# EAGLE design DebugCAN_v2 (EAGLE 9.7.0)

## Sheet 1 of 2
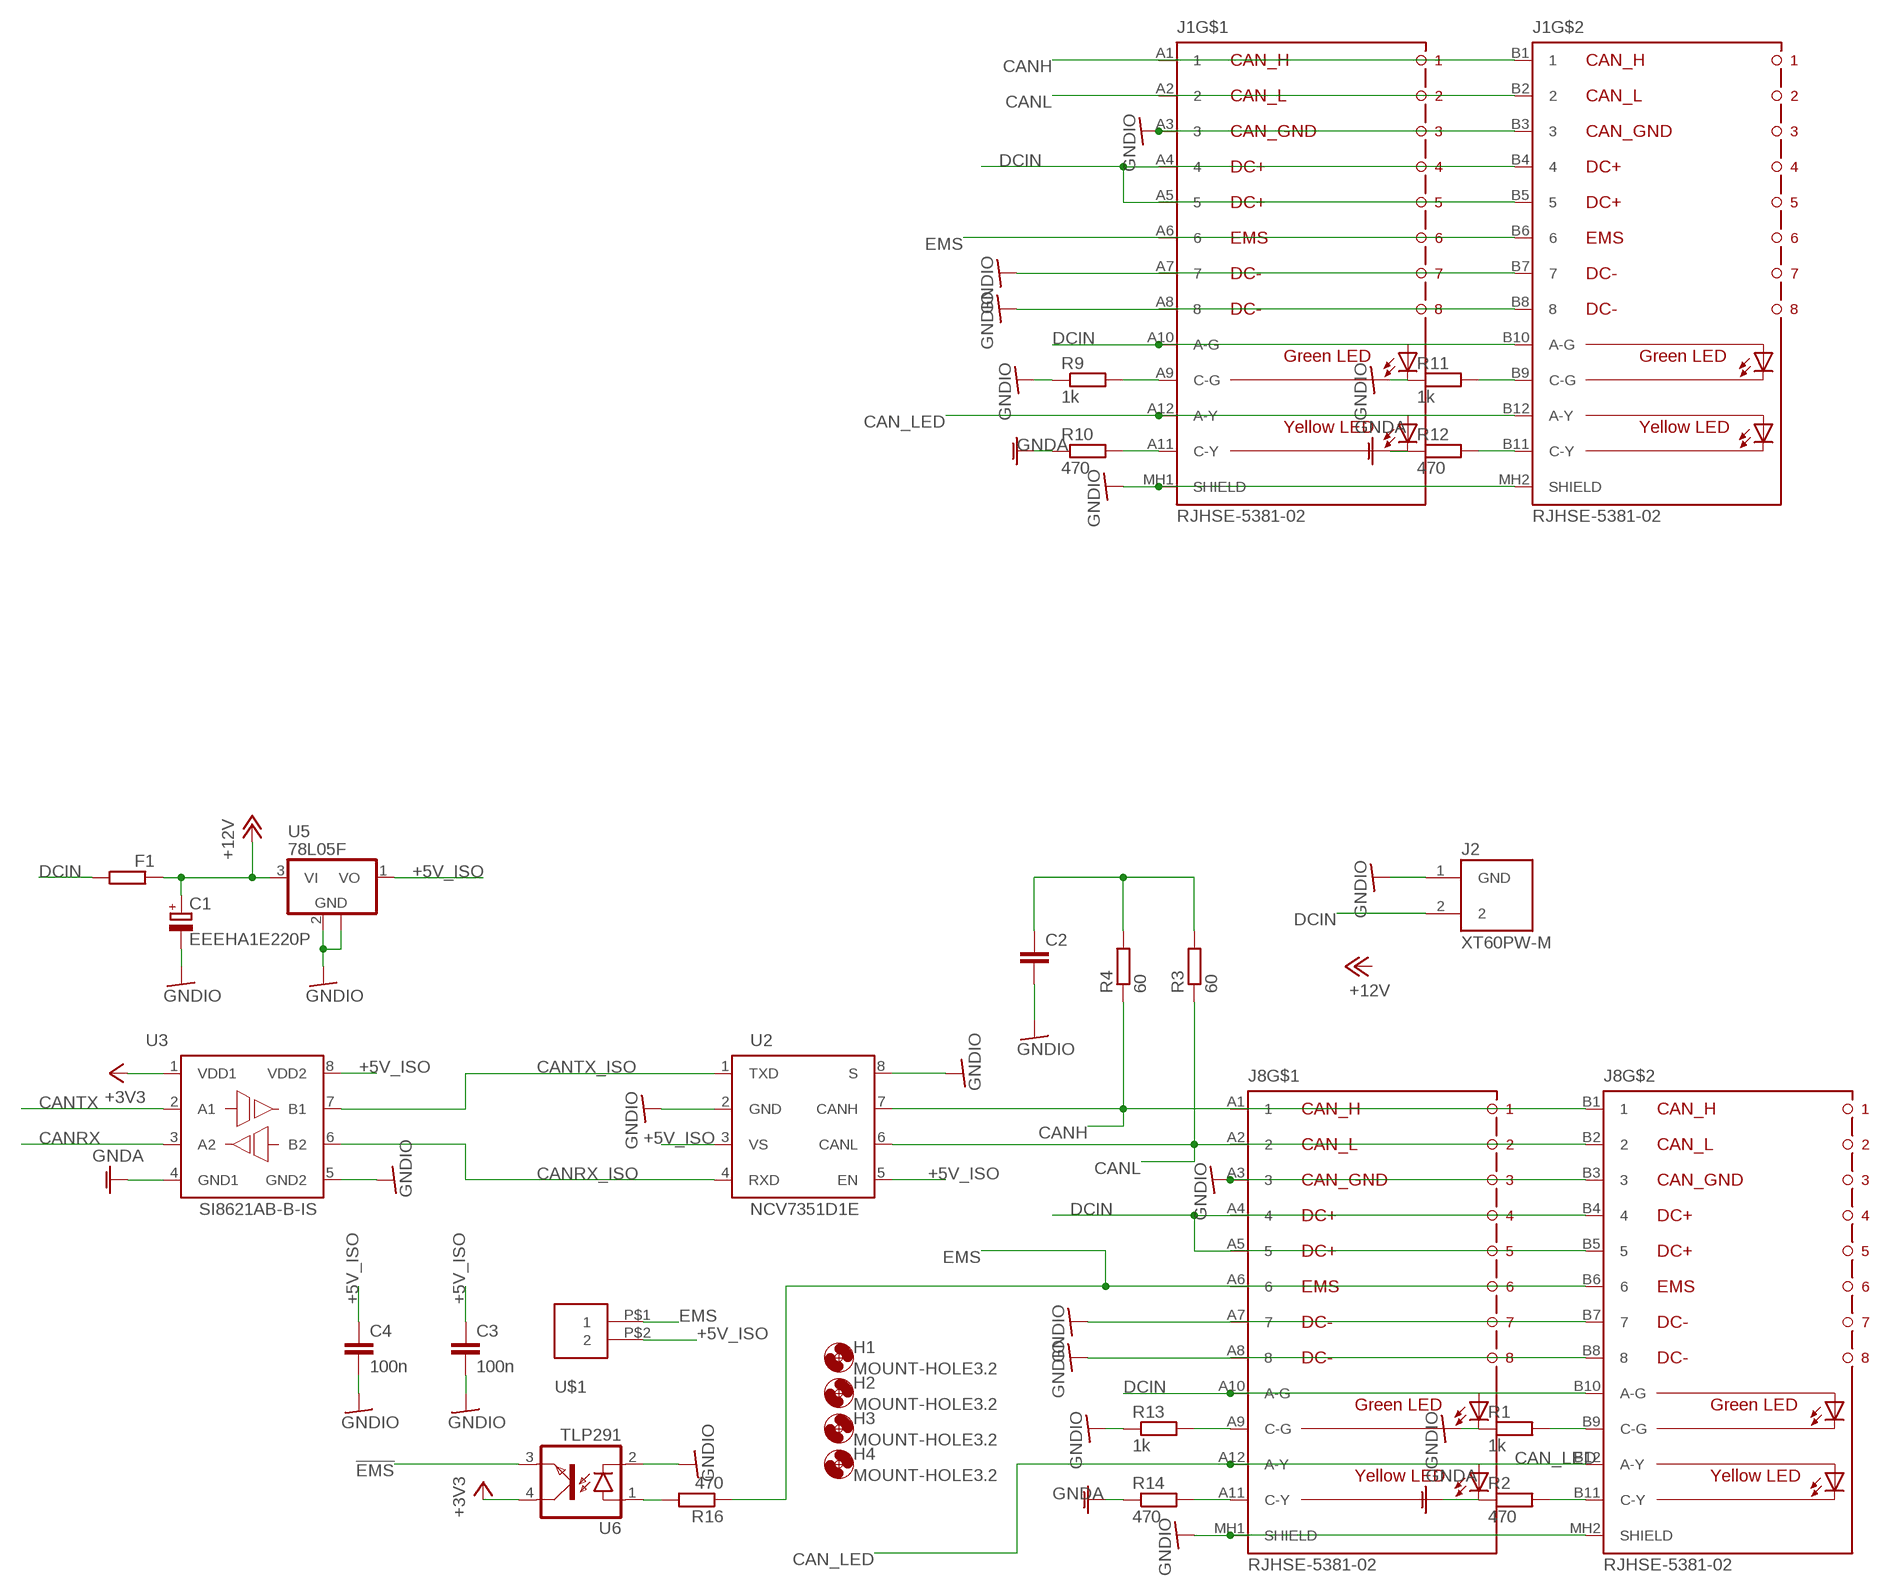
[diagram p0: schematic, sheet 1]

### Parts
C1  EEEHA1E220P  CPOL-EU153CLV-0605  [153CLV-0605]
C2  C-EUC0603  [C0603]
C3  100n  C-EUC0603  [C0603]
C4  100n  C-EUC0603  [C0603]
F1  R-EU_R1206  [R1206]
H1  MOUNT-HOLE3.2  [3,2]
H2  MOUNT-HOLE3.2  [3,2]
H3  MOUNT-HOLE3.2  [3,2]
H4  MOUNT-HOLE3.2  [3,2]
J1  RJHSE-5381-02  [RJHSE538102]
J2  XT60PW-M  [AMASS_XT60PW-M]
J8  RJHSE-5381-02  [RJHSE538102]
R1  1k  R-EU_R0603  [R0603]
R2  470  R-EU_R0603  [R0603]
R3  60  R-EU_R0603  [R0603]
R4  60  R-EU_R0603  [R0603]
R9  1k  R-EU_R0603  [R0603]
R10  470  R-EU_R0603  [R0603]
R11  1k  R-EU_R0603  [R0603]
R12  470  R-EU_R0603  [R0603]
R13  1k  R-EU_R0603  [R0603]
R14  470  R-EU_R0603  [R0603]
R16  470  R-EU_R0603  [R0603]
U2  NCV7351D1E  [SO08]
U3  SI8621AB-B-IS  [SO08]
U5  78L05F  [SOT89]
U6  TLP291  [MINI-FLAT-4]
U$1  XH-2-STRAIGHT  [CON-XH-2-STRAIGHT]

### Nets
!EMS: U6.3(EMIT) ; also sheet 2
+3V3: U3.1(VDD1) U6.4(COL) ; also sheet 2
+5V_ISO [wide]: C3.1 C4.1 U2.3(VS) U2.5(EN) U3.8(VDD2) U5.1(VO) U$1.P$2
+12V [6A]: C1.+ F1.1 U5.3(VI)
CAN_LED: J1.A12(A-Y) J1.B12(A-Y) J8.A12(A-Y) J8.B12(A-Y) ; also sheet 2
CANH: J1.A1 J1.B1 J8.A1 J8.B1 R4.1 U2.7(CANH)
CANL: J1.A2 J1.B2 J8.A2 J8.B2 R3.1 U2.6(CANL)
CANRX: U3.3(A2) ; also sheet 2
CANRX_ISO: U2.4(RXD) U3.6(B2)
CANTX: U3.2(A1) ; also sheet 2
CANTX_ISO: U2.1(TXD) U3.7(B1)
DCIN [6A]: F1.2 J1.A4 J1.A5 J1.A10(A-G) J1.B4 J1.B5 J1.B10(A-G) J2.2 J8.A4 J8.A5 J8.A10(A-G) J8.B4 J8.B5 J8.B10(A-G)
EMS: J1.A6 J1.B6 J8.A6 J8.B6 R16.1 U$1.P$1
GNDA: R2.1 R10.1 R12.1 R14.1 U3.4(GND1) ; also sheet 2
GNDIO: C1.- C2.2 C3.2 C4.2 J1.A3 J1.A7 J1.A8 J1.B3 J1.B7 J1.B8 J1.MH1(SHIELD) J1.MH2(SHIELD) J2.1(GND) J8.A3 J8.A7 J8.A8 J8.B3 J8.B7 J8.B8 J8.MH1(SHIELD) J8.MH2(SHIELD) R1.1 R9.1 R11.1 R13.1 U2.2(GND) U2.8(S) U3.5(GND2) U5.2(GND) U5.2@1(GND) U6.2(C)
N$1: J1.A9(C-G) R9.2
N$3: J8.B9(C-G) R1.2
N$4: J8.B11(C-Y) R2.2
N$6: C2.1 R3.2 R4.2
N$9: J1.A11(C-Y) R10.2
N$10: J1.B11(C-Y) R12.2
N$12: J1.B9(C-G) R11.2
N$13: J8.A11(C-Y) R14.2
N$14: J8.A9(C-G) R13.2
N$25: R16.2 U6.1(A)

## Sheet 2 of 2
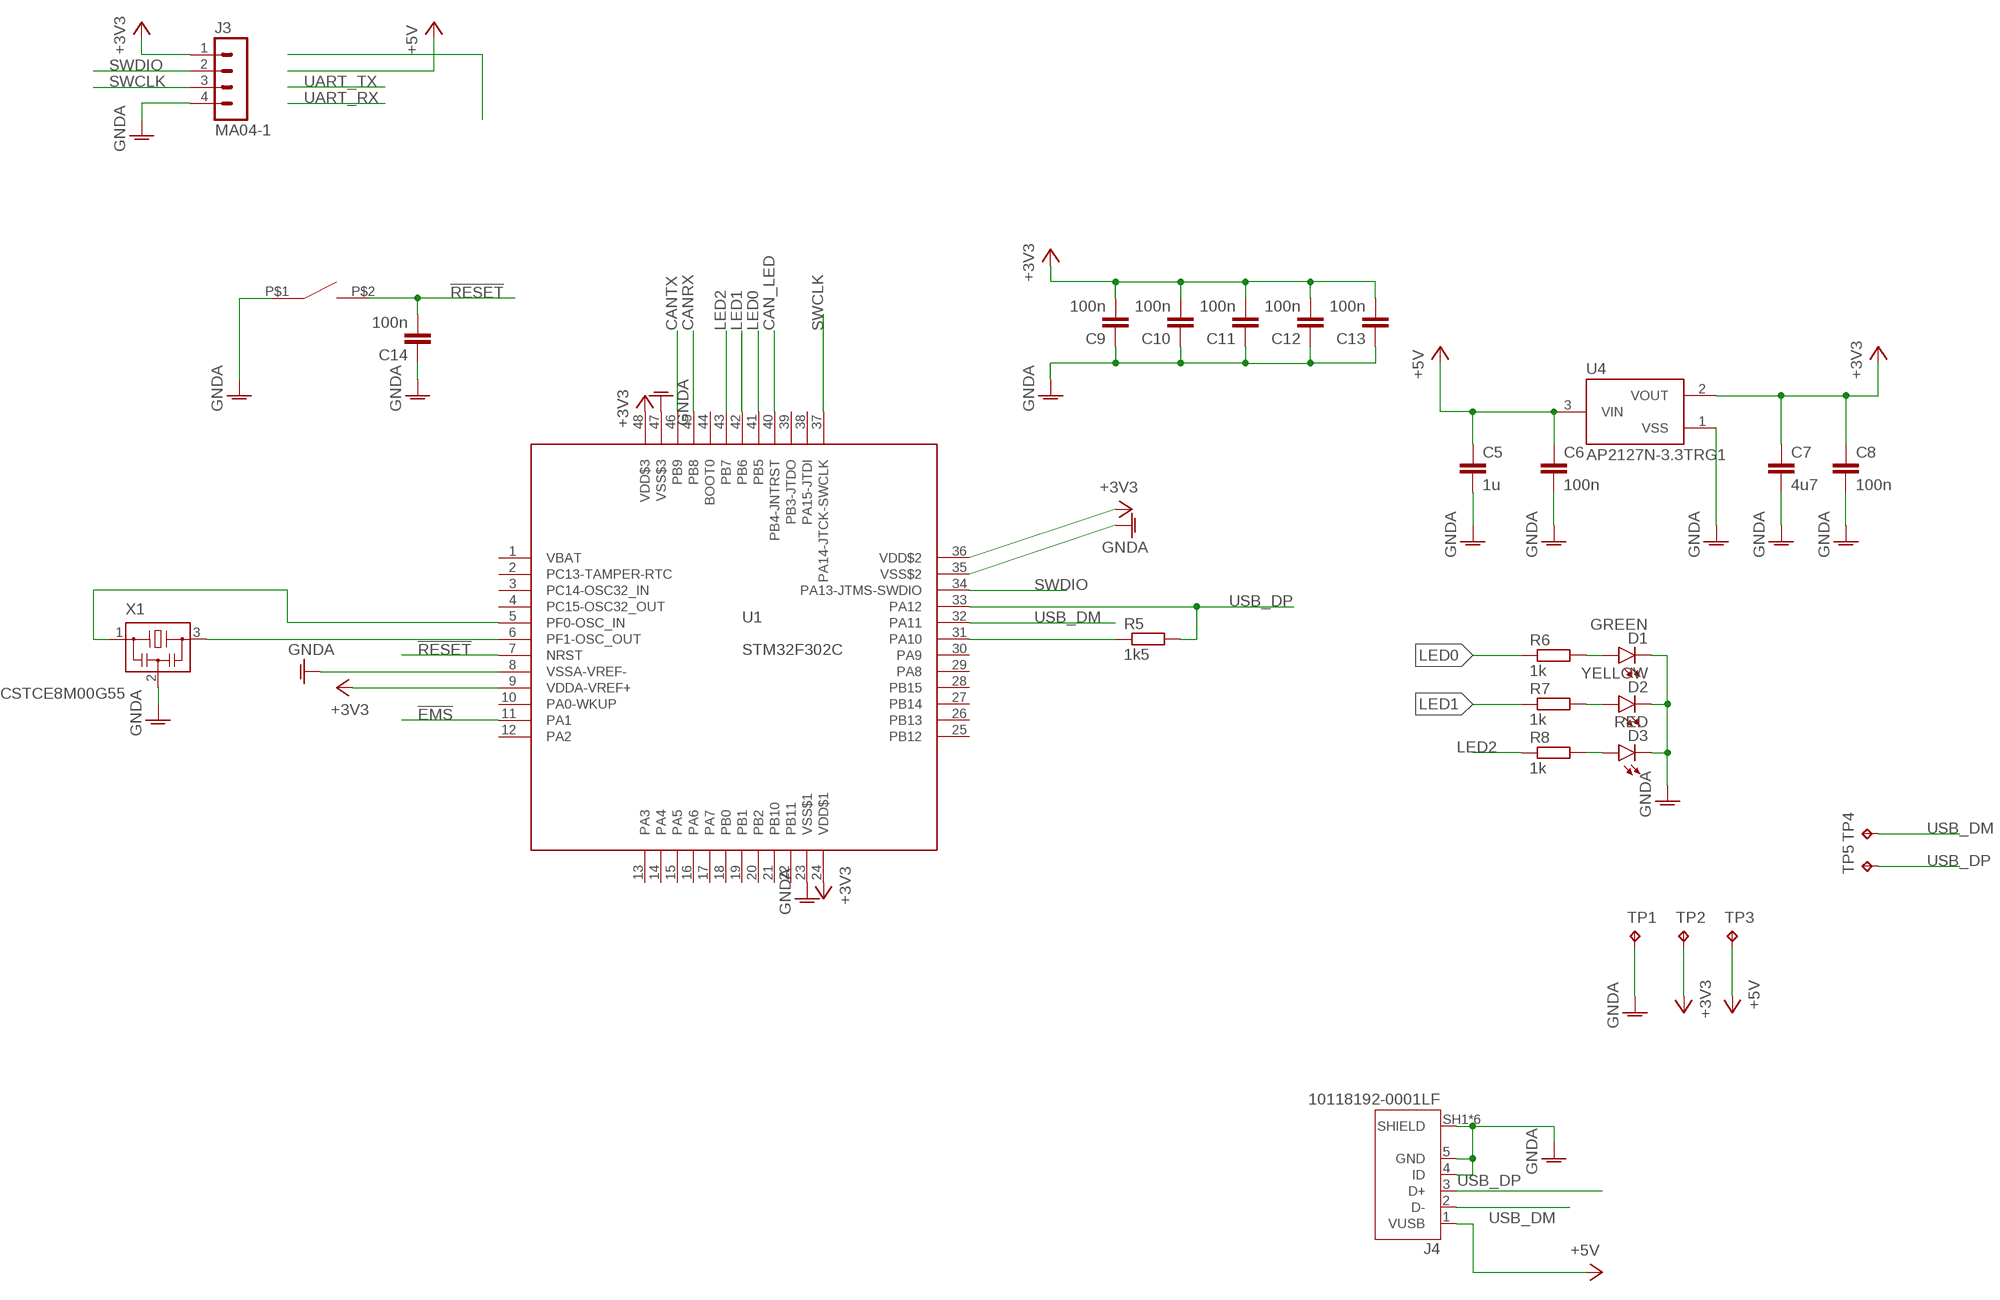
[diagram p1: schematic, sheet 2]

### Parts
C5  1u  C-EUC0603  [C0603]
C6  100n  C-EUC0603  [C0603]
C7  4u7  C-EUC0805  [C0805]
C8  100n  C-EUC0603  [C0603]
C9  100n  C-EUC0603  [C0603]
C10  100n  C-EUC0603  [C0603]
C11  100n  C-EUC0603  [C0603]
C12  100n  C-EUC0603  [C0603]
C13  100n  C-EUC0603  [C0603]
C14  100n  C-EUC0603  [C0603]
D1  GREEN  LEDCHIPLED_0805  [CHIPLED_0805]
D2  YELLOW  LEDCHIPLED_0805  [CHIPLED_0805]
D3  RED  LEDCHIPLED_0805  [CHIPLED_0805]
J3  MA04-1  [MA04-1]
J4  10118192-0001LF  [AMPHENOL_10118192-0001LF]
R5  1k5  R-EU_R0603  [R0603]
R6  1k  R-EU_R0603  [R0603]
R7  1k  R-EU_R0603  [R0603]
R8  1k  R-EU_R0603  [R0603]
S1  SWITCH_TACTILETOP  [SWITCH_TACTILE_3X6]
TP1  TPB1,27  [B1,27]
TP2  TPB1,27  [B1,27]
TP3  TPB1,27  [B1,27]
TP4  TPB1,27  [B1,27]
TP5  TPB1,27  [B1,27]
U1  STM32F302C  STM32F303C  [LQFP48]
U4  AP2127N-3.3TRG1  XC6206  [SOT95P240X110-3]
X1  CSTCE8M00G55  [CSTCE8M00G55]

### Nets
!EMS: U1.11(PA1) ; also sheet 1
!RESET: C14.2 S1.P$2 U1.7(NRST)
+3V3: C7.1 C8.1 C9.2 C10.2 C11.2 C12.2 C13.2 J3.1 TP2.TP U1.9(VDDA-VREF+) U1.24(VDD$1) U1.36(VDD$2) U1.48(VDD$3) U4.2(VOUT) ; also sheet 1
+5V [wide]: C5.1 C6.1 J4.1(VUSB) TP3.TP U4.3(VIN)
CAN_LED: U1.40(PB4-JNTRST) ; also sheet 1
CANRX: U1.45(PB8) ; also sheet 1
CANTX: U1.46(PB9) ; also sheet 1
GNDA: C5.2 C6.2 C7.2 C8.2 C9.1 C10.1 C11.1 C12.1 C13.1 C14.1 D1.C D2.C D3.C J3.4 J4.4(ID) J4.5(GND) J4.SH1(SHIELD) J4.SH2(SHIELD) J4.SH3(SHIELD) J4.SH4(SHIELD) J4.SH5(SHIELD) J4.SH6(SHIELD) S1.P$1 TP1.TP U1.8(VSSA-VREF-) U1.23(VSS$1) U1.35(VSS$2) U1.47(VSS$3) U4.1(VSS) X1.2 ; also sheet 1
LED0: R6.1 U1.41(PB5)
LED1: R7.1 U1.42(PB6)
LED2: R8.1 U1.43(PB7)
N$2: D2.A R7.2
N$5: D1.A R6.2
N$7: U1.6(PF1-OSC_OUT) X1.3
N$8: U1.5(PF0-OSC_IN) X1.1
N$11: R5.1 U1.31(PA10)
N$21: D3.A R8.2
SWCLK: J3.3 U1.37(PA14-JTCK-SWCLK)
SWDIO: J3.2 U1.34(PA13-JTMS-SWDIO)
USB_DM: J4.2(D-) TP4.TP U1.32(PA11)
USB_DP: J4.3(D+) R5.2 TP5.TP U1.33(PA12)
Unconnected: U1.1(VBAT) U1.2(PC13-TAMPER-RTC) U1.3(PC14-OSC32_IN) U1.4(PC15-OSC32_OUT) U1.10(PA0-WKUP) U1.12(PA2) U1.13(PA3) U1.14(PA4) U1.15(PA5) U1.16(PA6) U1.17(PA7) U1.18(PB0) U1.19(PB1) U1.20(PB2) U1.21(PB10) U1.22(PB11) U1.25(PB12) U1.26(PB13) U1.27(PB14) U1.28(PB15) U1.29(PA8) U1.30(PA9) U1.38(PA15-JTDI) U1.39(PB3-JTDO) U1.44(BOOT0)

## Library data of the parts
C1 = rcl:CPOL-EU: POLARIZED CAPACITOR, European symbol; SPICEPREFIX: C
C2-C4 = rcl:C-EU: CAPACITOR, European symbol; SPICEPREFIX: C
C5-C14 = rcl:C-EU: CAPACITOR, European symbol
D1-D3 = led:LED: LED OSRAM: - CHIPLED LG R971, LG N971, LY N971, LG Q971, LY Q971, LO R971, LY R971 LH N974, LH R974 LS Q976, LO Q976, LY Q976 LO Q996 - Hyper CHIPLED LW Q18S LB Q993, LB Q99A, LB R99A - SideLED LS A670, LO A670, LY A670, LG A670, LP A670 LB A673, LV A673, LT A673, LW A673 LH A674 LY A675 LS A676, LA A676, LO A676, LY A676, LW A676 LS A679, LY A679, LG A679 - Hyper Micro SIDELED® LS Y876, LA Y876, LO Y876, LY Y876 LT Y87S - SmartLED LW L88C, LW L88S LB L89C, LB L89S, LG L890 LS L89K, LO L89K, LY L89K LS L896, LA L896, LO L896, LY L896 - TOPLED LS T670, LO T670, LY T670, LG T670, LP T670 LSG T670, LSP T670, LSY T670, LOP T670, LYG T670 LG T671, LOG T671, LSG T671 LB T673, LV T673, LT T673, LW T673 LH T674 LS T676, LA T676, LO T676, LY T676, LB T676, LH T676, LSB T676, LW T676 LB T67C, LV T67C, LT T67C, LS T67K, LO T67K, LY T67K, LW E67C LS E67B, LA E67B, LO E67B, LY E67B, LB E67C, LV E67C, LT E67C LW T67C LS T679, LY T679, LG T679 LS T770, LO T770, LY T770, LG T770, LP T770 LB T773, LV T773, LT T773, LW T773 LH T774 LS E675, LA E675, LY E675, LS T675 LS T776, LA T776, LO T776, LY T776, LB T776 LHGB T686 LT T68C, LB T68C - Hyper Mini TOPLED® LB M676 - Mini TOPLED Santana® LG M470 LS M47K, LO M47K, LY M47K Source: http://www.osram.convergy.de LUXEON: - LUMILED® LXK2-PW12-R00, LXK2-PW12-S00, LXK2-PW14-U00, LXK2-PW14-V00 LXK2-PM12-R00, LXK2-PM12-S00, LXK2-PM14-U00 LXK2-PE12-Q00, LXK2-PE12-R00, LXK2-PE12-S00, LXK2-PE14-T00, LXK2-PE14-U00 LXK2-PB12-K00, LXK2-PB12-L00, LXK2-PB12-M00, LXK2-PB14-N00, LXK2-PB14-P00, LXK2-PB14-Q00 LXK2-PR12-L00, LXK2-PR12-M00, LXK2-PR14-Q00, LXK2-PR14-R00 LXK2-PD12-Q00, LXK2-PD12-R00, LXK2-PD12-S00 LXK2-PH12-R00, LXK2-PH12-S00 LXK2-PL12-P00, LXK2-PL12-Q00, LXK2-PL12-R00 Source: www.luxeon.com KINGBRIGHT: KA-3528ASYC Source: www.kingbright.com
F1 R1-R4 R9-R14 R16 = rcl:R-EU_: RESISTOR, European symbol; SPICEPREFIX: R
H1-H4 = holes:MOUNT-HOLE: MOUNTING HOLE with drill center marker
J1 J8 = con-rj45:RJHSE-5381-02: Modular Connectors / Ethernet Connectors R/A RJ45 SHEILDED 2 PORT Y/G LEDS Source: Datasheet <https://componentsearchengine.com/Datasheets/1/RJHSE-5381-02.pdf>; DESCRIPTION: Modular Connectors / Ethernet Connectors R/A RJ45 SHEILDED 2 PORT Y/G LEDS; HEIGHT: 13.46mm; MANUFACTURER_NAME: Amphenol; MANUFACTURER_PART_NUMBER: RJHSE-5381-02; MOUSER_PART_NUMBER: 523-RJHSE-5381-02; MOUSER_PRICE-STOCK: https://www.mouser.com/Search/Refine.aspx?Keyword=523-RJHSE-5381-02
J2 = con-xt:XT60PW-M; AVAILABILITY: Unavailable; MF: AMASS; MP: XT60PW-M; PACKAGE: Package Analog Devices; PRICE: None
J3 = con-headers:MA04-1
J4 = con-usb:10118192-0001LF: Single Port 5 Contact Horizontal Right Angle Shielded Micro B USB 2.0 Connector; DESCRIPTION: USB - micro B USB 2.0 Receptacle Connector 5 Position Surface Mount, Right Angle; DIGI-KEY_PART_NUMBER: 609-4613-1-ND; DIGI-KEY_PURCHASE_URL: https://www.digikey.com/product-detail/en/amphenol-icc-fci/10118192-0001LF/609-4613-1-ND/2785378?utm_source=snapeda&utm_medium=aggregator&utm_campaign=symbol; MF: Amphenol ICC; MP: 10118192-0001LF; PACKAGE: None
R5-R8 = rcl:R-EU_: RESISTOR, European symbol
S1 = switch-tactile:SWITCH_TACTILE
TP1-TP5 = testpad:TP: Test pad
U1 = stm32_mcu:STM32F303C*
U2 = on-semi:NCV7351D1E: High Speed CAN Transceiver Source: NCV7351-D.PDF <http://www.onsemi.com/PowerSolutions/document/NCV7351-D.PDF>
U3 = silabs:SI8621AB-B-IS: 1 Mbps Digital Isolator 1 Mbps, 2.5 kVRMS Digital Isolator Source: Si86xx.pdf <https://www.silabs.com/documents/public/data-sheets/Si86xx.pdf>
U4 = torex:XC6206
U5 = linear:78L*: POSITOIV-VOLTAGE REGULATORS Output up to 100 mA Source: Datasheet <http://focus.ti.com/lit/ds/symlink/ua78l05.pdf>
U6 = toshiba:TLP291: TOSHIBA PHOTOCOUPLER GaAs IRED & PHOTO-TRANSISTOR; OC_FARNELL: unknown; OC_NEWARK: unknown
U$1 = con-xh:XH-2-STRAIGHT
X1 = resonator:CSTCE8M00G55

## Net classes
0 default: width 0.25 mm
1 wide: width 0.5 mm
2 6A: width 1.5 mm

## Board
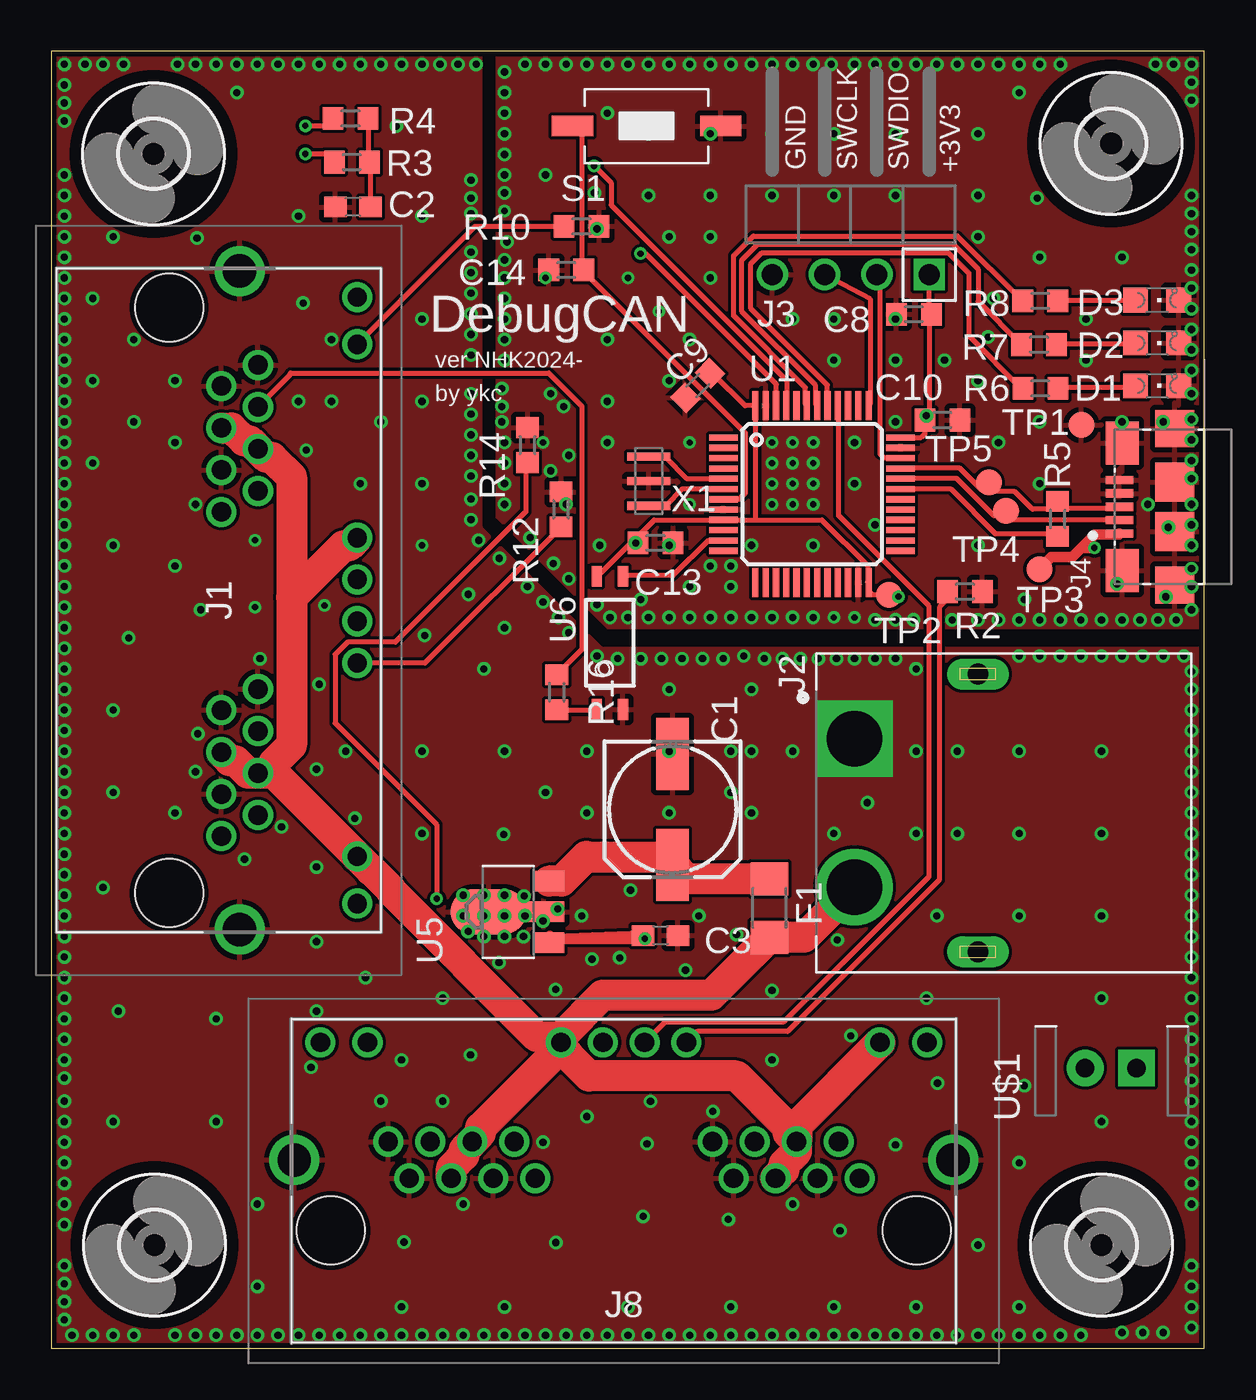
[diagram p2: board, top side]
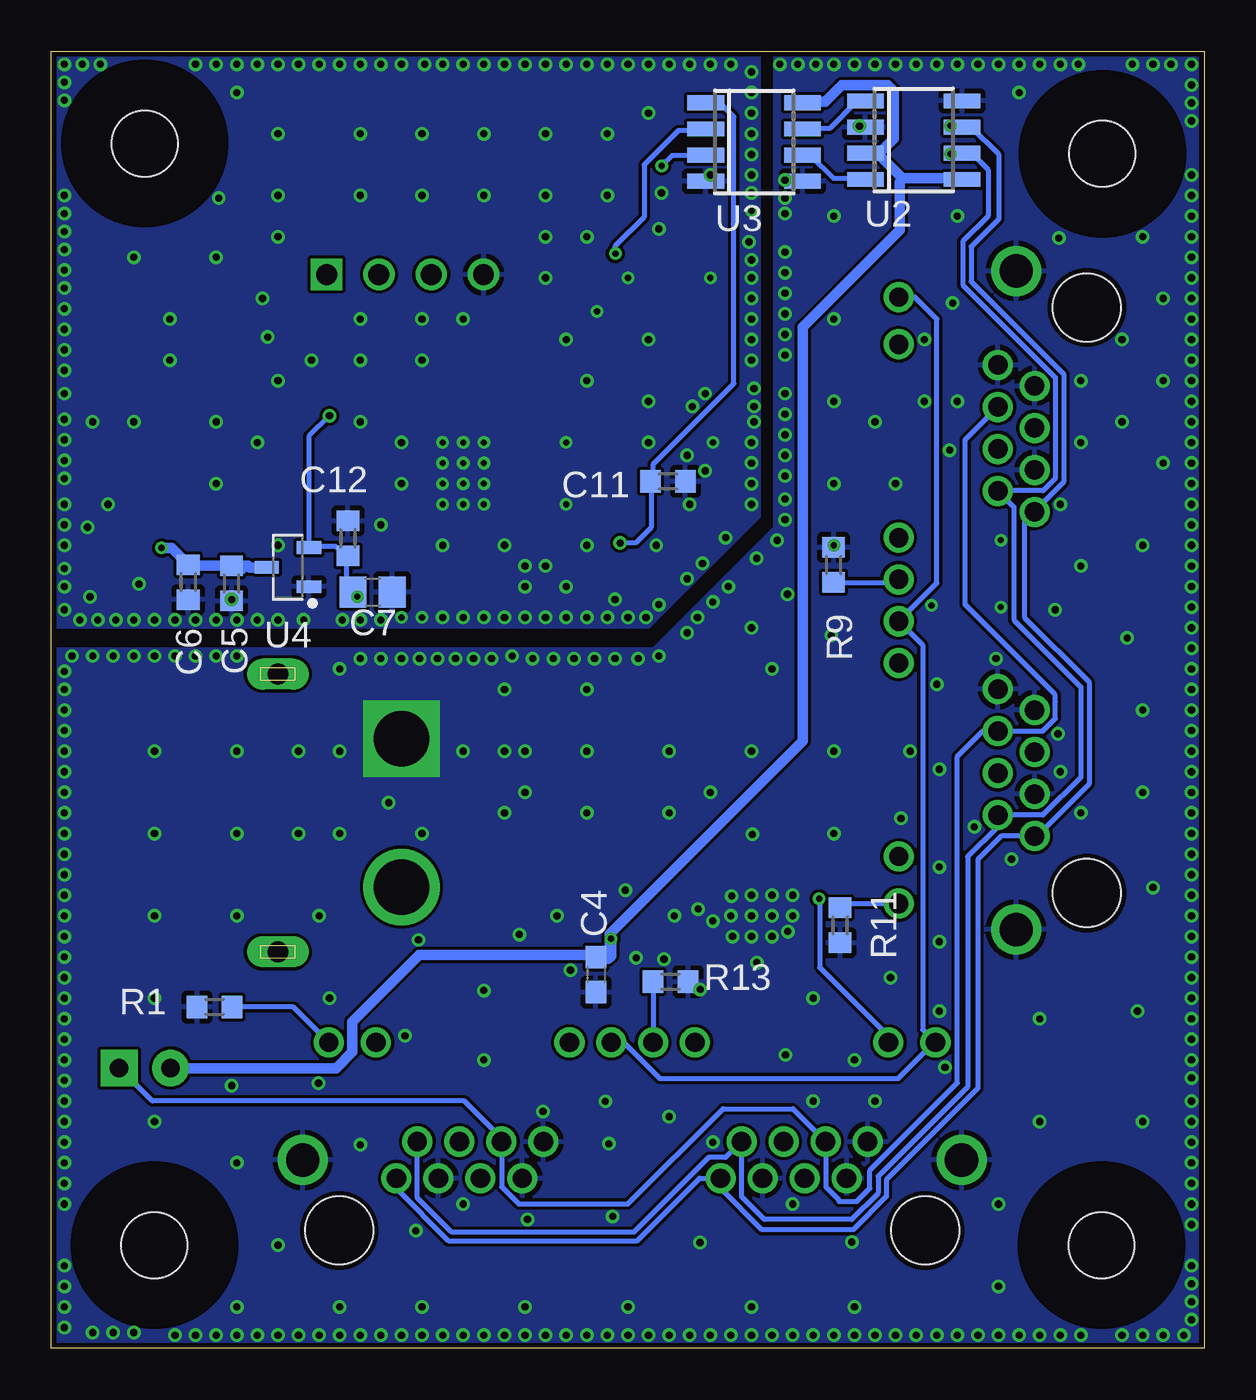
[diagram p3: board, bottom side, seen from below]

Size 56 x 63 mm. Coordinates in mm from the lower left corner, seen from the top.
Outline: 0,0 56,0 56,63 0,63 0,0
Copper layers (1*16): Top 0.035mm / dielectric 1.5mm / Bottom 0.035mm
Design rules "SeeedStudio_2layer_DRU_no_angle_20140221": minimum track width 6mil, minimum drill 12mil, track to track 6mil, track to pad 6mil, pad to pad 6mil, via to via 6mil, smd to smd 0mil, copper to edge 10mil, drill to drill 10mil, minimum pad ring 10mil, minimum via ring 6mil, stop-mask expansion 2mil, vias tented up to drill 100mil, thermal gap 10mil

### Footprints (pad centres in the part's own frame; a part is rotated, then mirrored left to right if it is on the bottom)
153CLV-0605 = smd 3.5 x 1.6: + 2.7,0; - -2.7,0
C0603 = smd 1.1 x 1: 1 -0.85,0; 2 0.85,0
C0603' = smd 1 x 1.1: 1 -0.85,0; 2 0.85,0
C0805 = smd 1.3 x 1.5: 1 -0.95,0; 2 0.95,0
CHIPLED_0805 = smd 1.2 x 1.2: A 0,-1.05; C 0,1.05
R1206 = smd 1.6 x 1.803: 1 -1.422,0; 2 1.422,0
3,2 = hole 3.2: 0,0
RJHSE538102 = drill 0.94 pad 1.462: A1 0,0; A2 -1.02,1.78; A3 -2.04,0; A4 -3.06,1.78; A5 -4.08,0; A6 -5.1,1.78; A7 -6.12,0; A8 -7.14,1.78; A9 3.28,6.6; A10 1.25,6.6; A11 -8.15,6.6; A12 -10.44,6.6; B1 15.75,0; B2 14.73,1.78; B3 13.71,0; B4 12.69,1.78; B5 11.67,0; B6 10.65,1.78; B7 9.63,0; B8 8.61,1.78; B9 19.03,6.6; B10 16.74,6.6; B11 7.34,6.6; B12 5.31,6.6 | drill 1.62 pad 2.43: MH1 -11.705,0.89; MH2 20.295,0.89 | hole 3.3: -9.93,-2.54; 18.52,-2.54
AMASS_XT60PW-M = drill 2.7 square: 1 -3.6,-6 | drill 2.7: 2 3.6,-6 | drill 1 pad 1.2 long: S1 -6.75,0; S2 6.75,0
MA04-1 = drill 1.016 square: 1 3.81,0 | drill 1.016: 2 1.27,0; 3 -1.27,0; 4 -3.81,0
AMPHENOL_10118192-0001LF = smd 0.4 x 1.35: 1 -1.3,0; 2 -0.65,0; 3 0,0; 4 0.65,0; 5 1.3,0 | smd 2.1 x 1.6: SH1 -3.1,-0.125; SH2 3.1,-0.125 | smd 1.8 x 1.9: SH3 -3.8,-2.675; SH6 3.8,-2.675 | smd 1.9 x 1.9: SH4 -1.2,-2.675; SH5 1.2,-2.675
R0603 = smd 1 x 1.1: 1 -0.85,0; 2 0.85,0
SWITCH_TACTILE_3X6 = smd 2 x 1: P$1 -3.6,0; P$2 3.6,0
B1,27 = smd 1.27 x 1.27: TP 0,0
LQFP48 = smd 1.4 x 0.3: 1 -4.3,2.75; 2 -4.3,2.25; 3 -4.3,1.75; 4 -4.3,1.25; 5 -4.3,0.75; 6 -4.3,0.25; 7 -4.3,-0.25; 8 -4.3,-0.75; 9 -4.3,-1.25; 10 -4.3,-1.75; 11 -4.3,-2.25; 12 -4.3,-2.75; 25 4.3,-2.75; 26 4.3,-2.25; 27 4.3,-1.75; 28 4.3,-1.25; 29 4.3,-0.75; 30 4.3,-0.25; 31 4.3,0.25; 32 4.3,0.75; 33 4.3,1.25; 34 4.3,1.75; 35 4.3,2.25; 36 4.3,2.75 | smd 0.3 x 1.4: 13 -2.75,-4.3; 14 -2.25,-4.3; 15 -1.75,-4.3; 16 -1.25,-4.3; 17 -0.75,-4.3; 18 -0.25,-4.3; 19 0.25,-4.3; 20 0.75,-4.3; 21 1.25,-4.3; 22 1.75,-4.3; 23 2.25,-4.3; 24 2.75,-4.3; 37 2.75,4.3; 38 2.25,4.3; 39 1.75,4.3; 40 1.25,4.3; 41 0.75,4.3; 42 0.25,4.3; 43 -0.25,4.3; 44 -0.75,4.3; 45 -1.25,4.3; 46 -1.75,4.3; 47 -2.25,4.3; 48 -2.75,4.3
SO08 = smd 0.72 x 1.78: 1 -1.905,-2.35; 2 -0.635,-2.35; 3 0.635,-2.35; 4 1.905,-2.35; 5 1.905,2.35; 6 0.635,2.35; 7 -0.635,2.35; 8 -1.905,2.35
SOT95P240X110-3 = smd 1.18 x 0.609: 1 -1.024,0.95; 2 -1.024,-0.95; 3 1.024,0
SOT89 = smd 1 x 1.5: 1 -1.499,-1.981; 3 1.499,-1.981 | smd 1 x 2: 2 0,-1.727 | smd 2.2 x 3.7: 2@1 0,0.94
MINI-FLAT-4 = smd 1 x 0.5: 1 -3.24,0.635; 2 -3.24,-0.635; 3 3.24,-0.635; 4 3.24,0.635
CON-XH-2-STRAIGHT = drill 0.9 pad 1.778 square: P$1 1.21,-0.73 | drill 0.9 pad 1.778: P$2 -1.29,-0.73
CSTCE8M00G55 = smd 0.4 x 2.1: 1 -1.2,0; 2 0,0; 3 1.2,0

### Placement (x,y rotation side)
C1  30.16,26.18 270 top
C2  14.64,55.45 180 top
C3  29.58,20.04 0 top
C4  29.55,18.14 270 bottom
C5  1u  [C0603']  47.26,37.15 270 bottom
C6  100n  [C0603']  49.35,37.22 270 bottom
C7  40.4,36.73 0 bottom
C8  100n  [C0603']  41.88,50.23 180 top
C9  100n  [C0603']  31.39,46.77 45 top
C10  100n  [C0603']  43.27,45.09 180 top
C11  100n  [C0603']  26.06,42.1 180 bottom
C12  100n  [C0603']  41.6,39.34 270 bottom
C13  100n  [C0603']  29.34,39.12 180 top
C14  100n  [C0603']  25,52.38 0 top
D1  53.7,46.76 270 top
D2  53.7,48.84 270 top
D3  53.7,50.91 270 top
F1  34.88,21.38 270 top
H1  51.47,58.52 0 top
H2  4.96,58.02 0 top
H3  5,5 0 top
H4  51,5 0 top
J1  8.25,40.62 270 top
J2  45,26 270 top
J3  38.83,52.16 0 top
J4  51.88,40.88 90 top
J8  23.5,8.25 0 top
R1  48.08,16.57 0 bottom
R2  44.37,36.76 180 top
R3  14.59,57.62 0 top
R4  14.53,59.74 0 top
R5  48.87,40.29 90 top
R6  48.03,46.63 0 top
R7  47.97,48.76 0 top
R8  48.02,50.88 0 top
R9  18.01,38.05 270 bottom
R10  25.75,54.5 180 top
R11  17.7,20.54 90 bottom
R12  24.75,40.75 270 top
R13  25.93,17.8 180 bottom
R14  23.12,43.88 270 top
R16  24.54,31.87 270 top
S1  28.91,59.38 180 top
TP1  50.02,44.85 0 top
TP2  40.69,36.6 0 top
TP3  47.98,37.85 0 top
TP4  46.37,40.68 0 top
TP5  45.53,42.05 0 top
U1  36.94,41.49 0 top
U2  14.12,58.69 270 bottom
U3  21.87,58.6 270 bottom
U4  44.52,37.95 180 bottom
U5  22.18,21.2 90 top
U6  27.12,34.27 90 top
U$1  51.5,14.34 0 top
X1  29,42.12 270 top

### Tracks (layer width: path | path; a pad name or v marks a point on that pad's centre or on a via)
!EMS
  Top 0.25: U6.3 27.77,37.52 30.18,37.52 31.89,39.23 32.59,39.23 U1.11
!RESET
  Top 0.25: S1.P$2 25.35,59.35 25.75,58.95 25.75,52.38 C14.2 25.86,52.31 33.7,44.47 33.7,41.55 33.4,41.25 32.7,41.25 U1.7
+3V3  (via drill 0.3, 0.35)
  Top 0.25: C9.2 32.09,47.28 32.2,47.28 33.69,45.79 U1.48 34.2,45.67 34.2,40.24 | U6.4 26.56,37.52 28.02,38.98 | 34.2,40.24 U1.9 29.27,40.24 28.02,38.98 | 34.2,40.24 37.42,40.24 39.64,38.03 39.64,37.22 U1.24 39.69,36.79 39.87,36.62 40.6,36.62 TP2.TP 41.12,36.48 v41.15,36.51 | C13.2 v28.38,39.12 28.24,38.98 28.02,38.98 | J3.1 42.61,52.13 42.61,50.35 C8.1 42.62,50.12 42.62,45.43 v42.49,45.3 42.42,45.22 C10.2 42.42,44.42 42.24,44.24 U1.36
  Bottom 0.25: U3.1 24.14,60.56 23.59,60.56 22.85,59.83 22.85,46.86 26.76,42.96 26.76,42.25 26.86,42.15 C11.2 26.88,42.07 26.88,39.88 27.63,39.12 v28.38,39.12 | v41.15,36.51 41.35,36.72 C7.1 41.45,36.82 41.65,37.02 41.65,38.43 C12.2 41.7,38.45 42.18,38.93 43.46,38.93 U4.2 43.49,44.3 v42.49,45.3
+5V  (via drill 0.3)
  Top 0.5: 50.02,38.88 50.68,39.54 51.84,39.54 J4.1 | TP3.TP 48.57,38.43 48.99,38.43 49.57,38.43 50.02,38.88 | v50.65,38.88 50.02,38.88
  Bottom 0.5: U4.3 45.57,37.93 46.38,37.93 46.48,38.03 46.58,38.03 46.78,37.83 47.08,37.83 C5.1 47.28,38.03 49.29,38.03 C6.1 50.17,38.88 v50.65,38.88
+5V_ISO  (via drill 0.3)
  Top 0.5: 24.39,19.89 v28.82,19.89 | 24.39,19.89 24.34,19.89 24.19,20.03 U5.1 | 24.39,19.89 C3.1
  Bottom 0.5: 14.69,56.84 11.77,56.84 U2.5 | 14.69,56.84 15.89,58.05 16.4,58.05 U2.3 15.69,58.15 15.09,58.75 15.09,61.06 15.39,61.37 17.61,61.37 18.41,60.56 19.52,60.56 U3.8 | 28.97,18.91 29.48,18.91 C4.1 29.86,18.99 29.96,19.1 38.14,19.1 41.4,15.84 41.4,14.38 42.18,13.6 U$1.P$2 | 14.69,56.84 14.79,56.64 14.79,54.32 19.5,49.61 19.5,29.49 28.87,20.12 28.87,19.11 28.97,18.91 | v28.82,19.89 28.82,19.07 28.97,18.91
+12V
  Top 1.5: F1.1 30.84,22.8 C1.+ 29.8,23.84 26.03,23.84 25.98,23.89 24.78,22.69 U5.3
CAN_LED
  Top 0.25: U1.40 38.23,45.77 38.23,40.44 42.62,36.04 42.62,22.91 35.58,15.86 29.82,15.86 J8.B12
  Bottom 0.25: J8.B12 28.21,14.85 26.46,13.1 14.87,13.1 13.09,14.88 J8.A12 13.69,15.47 13.69,34.15 J1.B12 13,37.16 13,50 14.06,51.06 J1.A12
CANH  (via drill 0.3)
  Top 0.25: v12.33,59.39 13.32,59.39 R4.1
  Bottom 0.25: v12.33,59.39 12.3,59.35 11.77,59.35 U2.7 11.32,59.33 10,58 10,54.85 11.33,53.52 11.33,51.82 6.84,47.33 6.84,42.08 8.25,40.67 J1.A1 8.75,40.12 8.75,35.5 5.6,32.35 5.6,27.4 8.12,24.88 J1.B1 9.88,24.88 11,23.75 11,12.62 15.45,8.18 15.45,7.36 17.06,5.75 21.5,5.75 23.5,7.75 J8.A1 24.52,8.25 27.54,5.22 36.72,5.22 39.25,7.75 J8.B1
CANL  (via drill 0.3)
  Top 0.25: v12.33,58.02 13.68,58.02 13.68,57.64 R3.1
  Bottom 0.25: v12.33,58.02 11.8,58.02 U2.6 11.67,58.05 11.3,58.05 10.5,57.25 10.5,55 11.73,53.77 11.73,51.65 7.24,47.16 7.24,42.25 7.83,41.66 10.02,41.66 J1.A2 9.26,40.87 9.26,35.38 6.01,32.13 6.01,27.73 7.84,25.89 J1.B2 10.1,25.83 10.1,25.28 11.5,23.88 11.5,12.69 15.85,8.35 15.85,7.53 17.12,6.25 21.38,6.25 22.48,7.36 J8.A2 23.25,9.26 24.08,9.26 27.71,5.62 36.56,5.62 38.23,7.3 J8.B2
CANRX  (via drill 0.3)
  Top 0.25: v26.36,57.44 27.18,56.62 27.18,55.53 35.71,47 35.71,45.87 U1.45
  Bottom 0.25: v26.36,57.44 25.85,57.95 24.25,57.95 U3.3
CANRX_ISO
  Bottom 0.25: U2.4 16.5,56.84 18.01,56.84 19.11,57.95 19.52,57.95 U3.6
CANTX  (via drill 0.3)
  Top 0.25: v28.61,53.18 28.86,53.18 35.21,46.83 35.21,45.87 U1.46
  Bottom 0.25: v28.61,53.18 28.61,53.55 27.21,54.95 27.21,57.49 25.55,59.15 24.25,59.15 U3.2
CANTX_ISO
  Bottom 0.25: U3.7 19.52,59.25 18.21,59.25 16.9,60.56 16.5,60.56 U2.1
DCIN
  Top 1.5: J2.2 36.56,19.96 F1.2 32.05,17.14 26.76,17.14 24.75,15.13 | 24.75,15.13 J8.A10 24.75,14.61 | J8.A5 19.42,8.74 20.03,9.35 20.03,9.62 J8.A4 20.85,10.44 20.85,10.71 24.75,14.61 | J8.B5 35.58,8.66 35.58,8.93 36.19,9.54 J8.B4 | J8.B4 35.78,10.44 35.78,10.71 33.27,13.22 26.1,13.22 25.15,14.17 25.15,14.21 24.75,14.61 | J8.B10 36.19,10.8 J8.B4 | J1.B5 8.66,28.55 8.93,28.55 9.54,27.93 J1.B4 10.8,27.93 | 10.8,27.93 J1.B10 15.51,23.23 15.53,23.23 16.48,22.27 16.48,22.23 23.58,15.13 24.75,15.13 | J1.A10 14.45,38.98 14.17,38.98 11.66,36.47 | 10.8,27.93 10.8,28.43 11.66,29.3 11.66,36.47 | J1.A5 8.74,44.7 9.35,44.09 9.62,44.09 J1.A4 10.44,43.28 10.71,43.28 11.66,42.32 11.66,36.47
EMS
  Top 0.25: R16.1 25.77,33.95 25.77,45.77 24.16,47.38 11.61,47.38 11.61,47.3 J1.A6
  Bottom 0.25: U$1.P$1 51.1,12 35.94,12 34.15,10.21 J8.B6 34.14,10.02 34.14,7.83 33.31,7 28,7 23.38,11.62 20,11.62 J8.A6 18.39,10.02 18.39,7.83 17.75,7.19 17.75,7.12 16.88,7.12 16.25,7.75 16.25,8.62 12,12.88 12,28.75 10.78,29.98 J1.B6 7.84,29.98 7.24,30.58 7.24,31.41 7.25,31.42 7.25,31.75 11.62,36.12 11.62,44.13 J1.A6
GNDA  (via drill 0.3, 0.35)
  Top 0.5: C13.1 30.07,39 v30,39
  other vias: 31,41 31,44 37,41 37,42 37,43 37,44 36,44 36,43 35,44 35,43 36,42 35,41 36,41 28,52 24,52 22,55.25 29.5,50.38 39,35.5 38,35.5 23.88,44 35,42 27,49 37,39 34,39 33,38 33,37 31,37 33,35.5 32,35.5 32,38 31,35.5 30,35.5 29,35.5 28,35.5 27.12,35.5 26.62,39 25.12,37.38 24.25,42.62 21.88,45 25,41 55.38,56 55.38,52.38 52,53 50.25,50 48,53 45,56 47.88,55.88 45,59 45,62.38 48,62.38 55.38,62.38 54,45 52,45 48,45 50.25,48 45.75,51 45.5,49.12 54.12,36.5 51.75,37.12 47.25,36.38 45,35.38 45,39 54.25,39.88 48,42 46,44 45,47 41,45 43.38,48 41,50 41,48 38,50 38,48 36,50 31,49 32,52 32,56 32,59 35,59 35,56 38,56 38,59 41,59 41,62.38 37.88,62.38 41,56 35,62.38 32,62.38 45,54 25.12,43.38 27,46 30,47 27,60 24,57 29,59 29,56 30,54 29,62.38 26,62.38 23,62.38 24.25,46.38 27,44 32,54 53.25,41 36,35.5 37,35.5 34,35.5 35,35.5 22,62 22,61 22,60 22,59 22,58 22,57 22,56.12 22.12,53.75 22,52.88 22,52 40,35.38 22,51 22,50 22,49 22,48 21.88,46.62 21.88,45.75 24.38,38.12 24.88,45.75 22,44 23.25,39.38 22,43 22,42 22,41 34,62.38 33,62.38 31,62.38 30,62.38 28,62.38 27,62.38 25,62.38 24,62.38 26.5,36.12 28.62,36.38 42,62.38 43,62.38 44,62.38 49,62.38 47,62.38 46,62.38 40,62.38 39,62.38 37,62.38 36,62.38 55.38,54.25 55.38,55.12 55.38,53.38 55.38,61.5 55.38,60.62 54.5,62.38 53.62,62.38 43.75,35.38 46,35.38 47,35.38 48,35.38 49,35.38 50,35.38 51,35.38 52,35.38 52.88,35.38 53.75,35.38 54.62,35.38 55.38,35.88 55.38,37 55.38,37.88 55.38,39 55.38,40 55.38,41 55.38,42.25 55.38,43.12 41,35.38 41.88,35.38 55.38,51.5 55.38,49.5 55.38,50.5 55.38,48.5 55.38,47.5 55.38,46.38 55.38,45.12 55.38,44.12 26.5,54.38 26.38,56.12 39,44 39,42 40,40 47,61
  pour Bottom: 27,35 56,35 56,63 21.62,63 21.62,40.38
  pour Top: 27,35 56,35 56,63 21.62,63 21.62,40.38
GNDIO  (via drill 0.3, 0.35)
  other vias: 18,39 34,29 33,29 33,27 36,29 30,29 34,32 30,32 38.12,33.5 42,33 42,29 42,25 38,25 43,21 44,25 44,29 47,29 47,33.62 51,33.62 51,29 55.38,29 55.38,25 51,25 47,25 55.38,21 51,21 47,21 51,17 55.38,17 35,17.38 17,2 22,2 28,2 33,2 38,2 42,2 45,5 47,2 55.38,2 55.38,7 55.38,11 51,11 26.5,33.62 27.5,33.5 28.62,33.5 29.62,33.5 30.62,33.5 31.62,33.5 32.62,33.5 33.62,33.62 23.12,37 23.88,36.25 24.62,35.5 25.12,34.75 21.75,38.38 20.75,39.25 20.38,40.25 20.38,41.25 20.38,42.38 20.38,43.38 20.38,44.38 20.38,45.38 20.38,46.38 20.38,48.25 20.38,49.25 20.38,50.25 20.38,52.25 20.38,51.25 20.38,53.25 20.38,56.75 20.38,55.88 20.62,62.38 19.75,62.38 18.88,62.38 18,62.38 17,62.38 16,62.38 15,62.38 14,62.38 13,62.38 12,62.38 11,62.38 10,62.38 9,62.38 8,62.38 7,62.38 6.12,62.38 3.5,62.38 2.5,62.38 1.62,62.38 0.62,62.38 0.62,61.38 0.62,60.5 0.62,59.62 0.62,57 0.62,53 0.62,56 0.62,55 0.62,54 54,33.62 55,33.62 53,33.62 52,33.62 50,33.62 49,33.62 48,33.62 41,33.5 40,33.5 39,33.5 37.25,33.5 36.38,33.5 34.62,33.5 35.5,33.5 0.62,33 0.62,52 0.62,51 0.62,50 0.62,49 0.62,48 0.62,47 0.62,46 0.62,45 0.62,44 0.62,43 0.62,34 0.62,42 0.62,41 0.62,40 0.62,39 0.62,38 0.62,37 0.62,36 0.62,35 0.62,32 0.62,31 0.62,30 0.62,29 0.62,28 0.62,27 0.62,26 0.62,25 0.62,24 0.62,23 0.62,22 0.62,21 0.62,20 0.62,19 0.62,18 0.62,17 0.62,16 0.62,15 0.62,14 0.62,13.12 0.62,12 0.62,11 0.62,10 0.62,9 0.62,8 0.62,7 0.62,6 0.62,4 0.62,3.12 0.62,2.25 0.62,1.38 1,0.62 2,0.62 3,0.62 4,0.62 6,0.62 7,0.62 8,0.62 9,0.62 10,0.62 11,0.62 12,0.62 13,0.62 14,0.62 16,0.62 15,0.62 17,0.62 18,0.62 19,0.62 20,0.62 21,0.62 23,0.62 22,0.62 24,0.62 25,0.62 26,0.62 27,0.62 28,0.62 29,0.62 30,0.62 31,0.62 32,0.62 33,0.62 34,0.62 35,0.62 36,0.62 37,0.62 38,0.62 39,0.62 40,0.62 41,0.62 42,0.62 43,0.62 44,0.62 45,0.62 46,0.62 47,0.62 48,0.62 49,0.62 50,0.62 55.38,1 54,0.75 53,0.75 52,0.75 55.38,4 55.38,3 55.38,8 55.38,10 55.38,9 55.38,20 55.38,19 55.38,18 55.38,16 55.38,15 55.38,14 55.38,13 55.38,12 55.38,26 55.38,24 55.38,23 55.38,22 55.38,27 55.38,32.88 55.38,32 55.38,31 55.38,30 55.38,28 34,26 30,26 26,26 26,29 22,29 18,25 18,29 17,14 20,7 10,3 3,54 2,51 4,49 2,47 6,47 12,55 20.38,55.12 18,46 16,45 18,42 22,35 21,33 3.75,34.5 3,27 6,26 2.5,22.38 3.25,16.38 3,11 8,11 8,16 10,7 18,55 18,50 2,43 32.12,11.5 4,45 7,41 9,61 15.25,18 47.25,12.75 41,9.88 36,7 16.75,59.38 31.44,21 38.17,19.83 33.27,20.1 24.49,17.42 21.96,24.96 20,22 21,22 22,22 22,21 21,21 20,21 21,20 22,20 22.93,20 23,21 23.88,20.75 22.96,21.96 28.12,22.25 25.75,21 12.23,50.77 27.6,18.96 26.25,18.89 29.1,11.99 38.83,15.17 24.59,21.34 20.24,20.24 21.74,18.74 30.79,18.37 43.03,12.87 14.74,25.74 9.89,39.26 9.89,36 20.35,14.25 17.13,5.15 38.3,5.7 28.74,6.4 28.93,9.93 23.88,10 32.88,6.25 26,11.25 12.6,13.64 7.11,29.85 13.26,36.08 13.6,46 13.6,49 12,46 15,42 35,14 16,12 47,9 3,39 6,38 3,31 24,27 19,12 18.12,34.62 20.25,36.62 7.25,35.88 9.38,23.75 24.5,5.12 42.5,17 39.62,26.5 10.12,33.5 11.17,25.33 7,28 6,44 7.07,53.93 14.29,29 12.88,23.38 12.88,19.75 12.88,16.38 12.88,28.12 13,32.25 12.38,43.62 19,17
  pour Top: 26.77,34 26.74,34.01 20.89,39.86 20.88,39.89 20.88,63 0,63 0,0 56,0 56,34
  pour Bottom: 26.77,34 26.74,34.01 20.89,39.86 20.88,39.89 20.88,63 0,63 0,0 56,0 56,34
LED0
  Top 0.25: R6.1 47.11,46.63 44.55,49.19 44.55,52.24 43.57,53.22 34.51,53.22 33.98,52.69 33.98,50.51 37.69,46.79 U1.41
LED1
  Top 0.25: R7.1 45.01,50.87 45.01,52.42 43.79,53.63 34.3,53.63 33.54,52.87 33.54,50.36 37.12,46.78 37.12,45.87 U1.42
LED2
  Top 0.25: R8.1 47.14,50.88 44,54.03 34.09,54.03 33.14,53.07 33.14,50.16 36.62,46.68 36.62,45.87 U1.43
N$1
  Bottom 0.25: J1.A9 14.99,37.2 R9.2
N$2
  Top 0.25: R7.2 48.84,48.79 52.56,48.79 D2.A
N$3
  Bottom 0.25: J8.B9 44.25,16.57 R1.2
N$4
  Top 0.25: R2.2 43.52,36.39 43.12,36 43.12,22.75 35.75,15.38 31.36,15.38 J8.B11
N$5
  Top 0.25: R6.2 48.94,46.68 52.56,46.68 D1.A
N$6
  Top 0.25: R4.2 15.39,59.66 15.39,57.64 R3.2 15.49,57.54 15.49,55.53 C2.1
N$7
  Top 0.25: U1.6 32.59,41.75 30.66,41.75 29.85,40.94 29.07,40.94 X1.3
N$8
  Top 0.25: U1.5 32.59,42.25 30.83,42.25 29.83,43.26 29.07,43.26 X1.1
N$9
  Top 0.25: J1.A11 20.57,54.5 R10.2
N$10
  Top 0.25: R12.2 18.14,33.28 J1.B11
N$11
  Top 0.25: R5.1 48.75,39.56 45.87,39.56 43.68,41.75 U1.31
N$12
  Bottom 0.25: J1.B9 17.49,21.59 R11.2
N$13  (via drill 0.3)
  Top 0.25: R14.2 23.04,42.96 23.04,40.64 16.7,34.3 14.39,34.3 13.78,33.7 13.78,30.36 18.71,25.43 v18.71,21.83
  Bottom 0.25: J8.A11 15.39,14.89 15.39,15.19 18.69,18.49 18.69,21.81 v18.71,21.83
N$14
  Bottom 0.25: R13.2 J8.A9
N$21
  Top 0.25: R8.2 48.94,50.9 52.56,50.9 D3.A
N$25
  Top 0.25: U6.1 26.46,30.98 24.65,30.98 24.55,30.88 R16.2
SWCLK
  Top 0.25: U1.37 39.76,45.86 39.76,50.98 37.57,52.14 J3.3
SWDIO
  Top 0.25: U1.34 41.15,43.26 40.44,43.26 40.24,43.46 40.24,52.31 J3.2
USB_DM
  Top 0.25: J4.2 51.81,40.24 46.44,40.24 TP4.TP 45.77,40.44 43.96,42.25 41.25,42.25 U1.32
USB_DP
  Top 0.25: J4.3 51.8,40.8 48.95,40.8 R5.2 48.49,40.77 47.65,40.77 46.8,41.62 45.48,41.62 45.53,41.67 TP5.TP 45.18,41.7 44.12,42.76 41.25,42.76 U1.33

### Text on the board
tPlace: GND | SWCLK | SWDIO | +3V3 | DebugCAN | ver NHK2024-Ⅲ | by ykc